# EAGLE design registers (EAGLE 5.11)

## Sheet 1 of 3
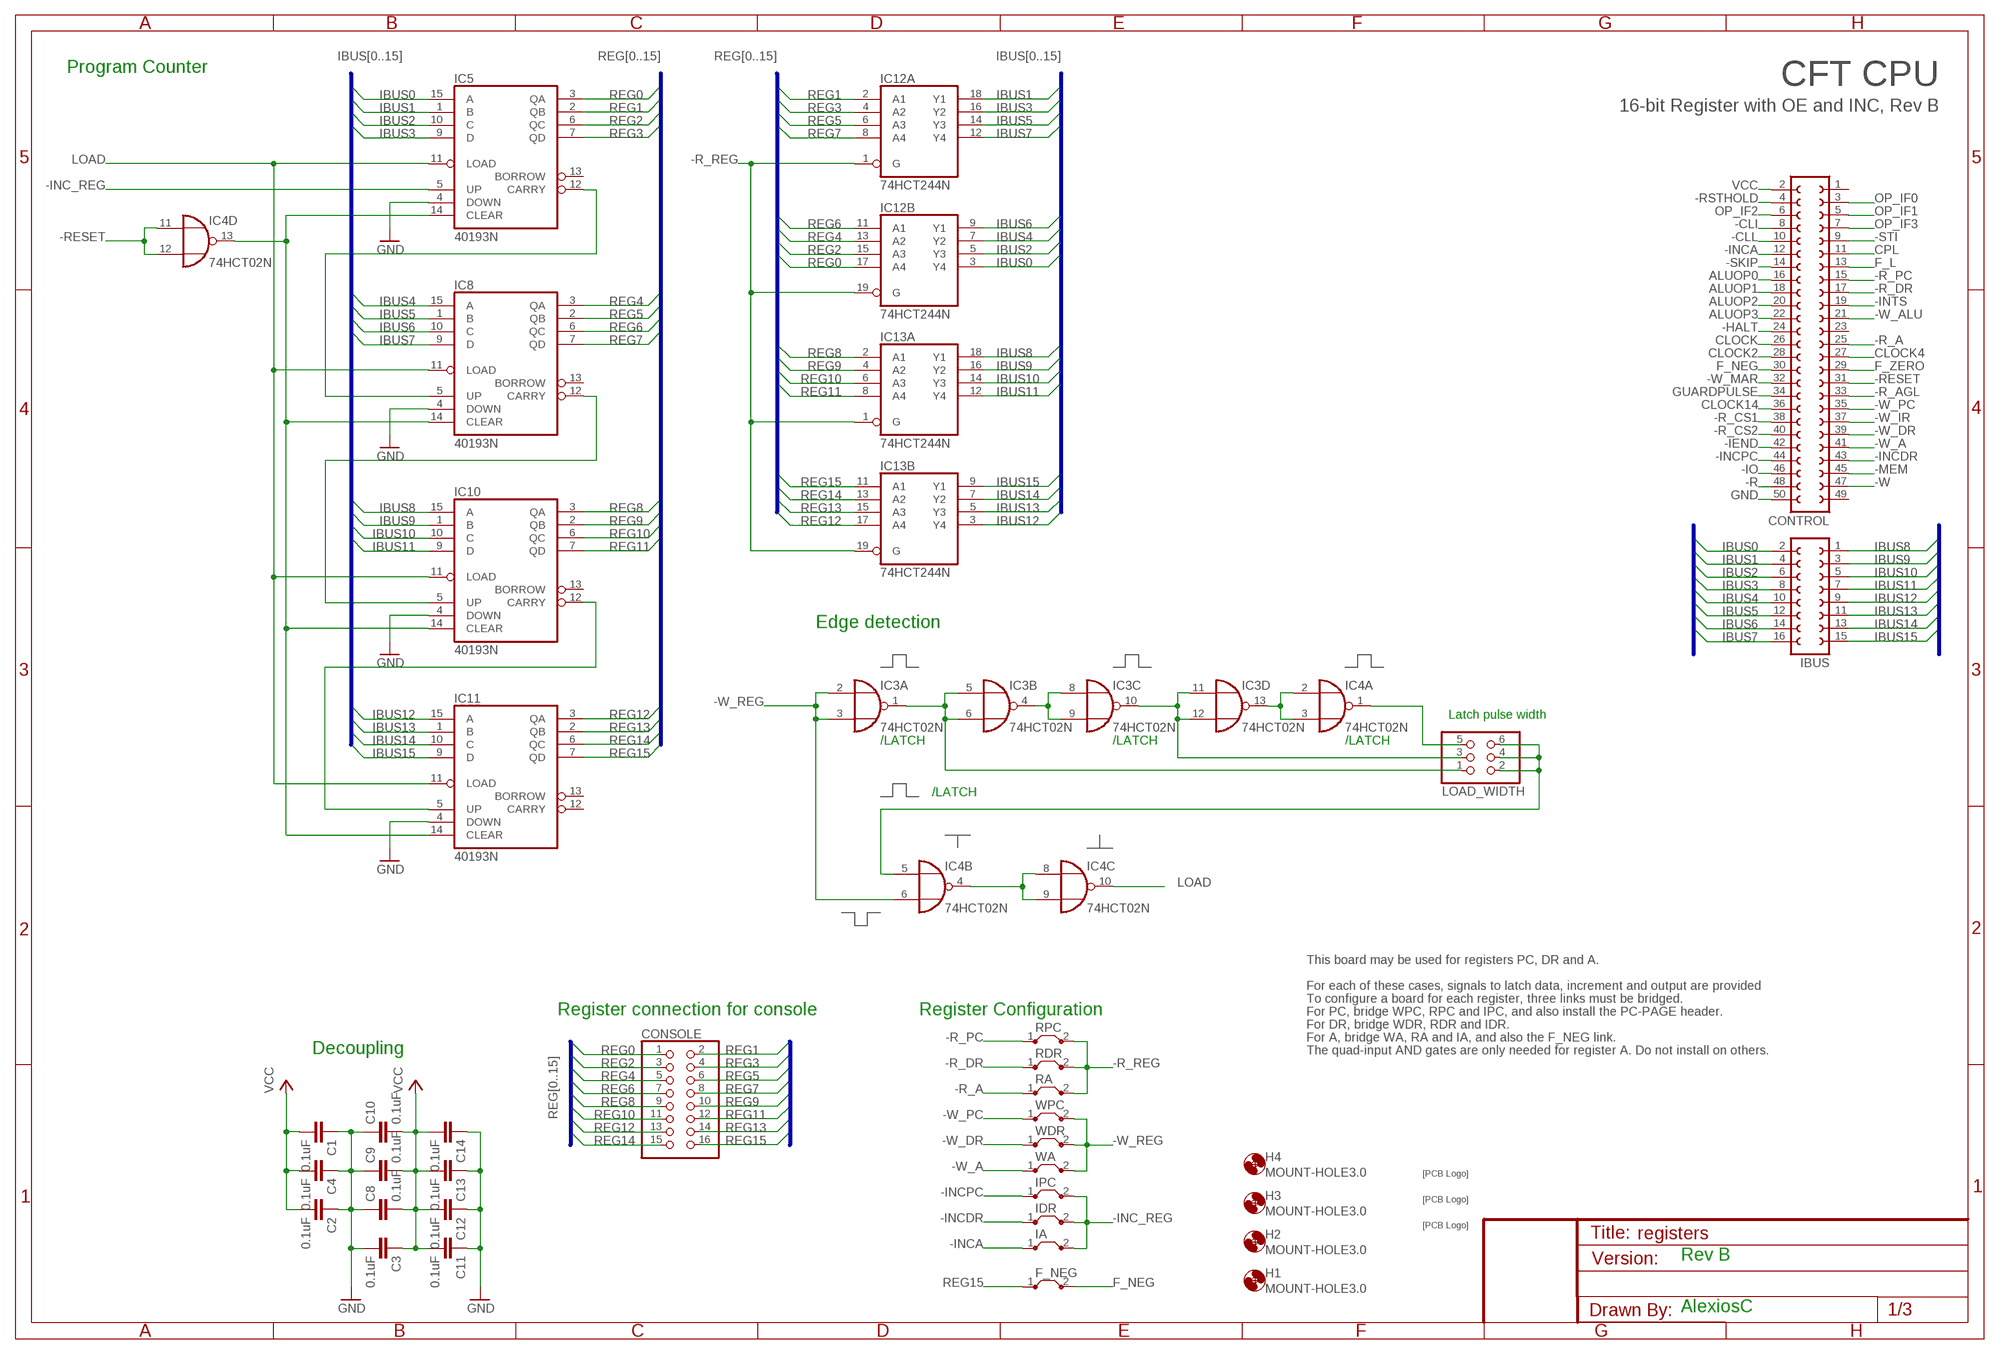
[diagram p0: schematic, sheet 1]

### Parts
C1  0.1uF  C-EU025-025X050  [C025-025X050]
C2  0.1uF  C-EU025-025X050  [C025-025X050]
C3  0.1uF  C-EU025-025X050  [C025-025X050]
C4  0.1uF  C-EU025-025X050  [C025-025X050]
C8  0.1uF  C-EU025-025X050  [C025-025X050]
C9  0.1uF  C-EU025-025X050  [C025-025X050]
C10  0.1uF  C-EU025-025X050  [C025-025X050]
C11  0.1uF  C-EU025-025X050  [C025-025X050]
C12  0.1uF  C-EU025-025X050  [C025-025X050]
C13  0.1uF  C-EU025-025X050  [C025-025X050]
C14  0.1uF  C-EU025-025X050  [C025-025X050]
CONSOLE  PINHD-2X8/90  [2X08/90]
CONTROL  FE25-2  [FE25-2]
F_NEG  J5MM  [05]
H1  MOUNT-HOLE3.0  [3,0]
H2  MOUNT-HOLE3.0  [3,0]
H3  MOUNT-HOLE3.0  [3,0]
H4  MOUNT-HOLE3.0  [3,0]
IA  J5MM  [05]
IBUS  FE08-2  [FE08-2]
IC3  74HCT02N  [DIL14]
IC4  74HCT02N  [DIL14]
IC5  40193N  [DIL16]
IC8  40193N  [DIL16]
IC10  40193N  [DIL16]
IC11  40193N  [DIL16]
IC12  74HCT244N  [DIL20]
IC13  74HCT244N  [DIL20]
IDR  J5MM  [05]
IPC  J5MM  [05]
LOAD_WIDTH  PINHD-2X3/90  [2X03/90]
RA  J5MM  [05]
RDR  J5MM  [05]
RPC  J5MM  [05]
U$1  SIGNATUREPLANE  [SIGNATURE_PLANE]
U$2  SIGNATUREPLANE  [SIGNATURE_PLANE]
U$3  SIGNATURESILK  [SIGNATURE]
WA  J5MM  [05]
WDR  J5MM  [05]
WPC  J5MM  [05]

### Nets
-CLI: CONTROL.8
-CLL: CONTROL.10
-HALT: CONTROL.24
-IEND: CONTROL.42
-INC_REG: IA.2 IC5.5(UP) IDR.2 IPC.2 ; also sheet 2,3
-INCA: CONTROL.12 IA.1
-INCDR: CONTROL.43 IDR.1
-INCPC: CONTROL.44 IPC.1
-INTS: CONTROL.19
-IO: CONTROL.46
-MEM: CONTROL.45
-R: CONTROL.48
-R_A: CONTROL.25 RA.1
-R_AGL: CONTROL.33
-R_CS1: CONTROL.38
-R_CS2: CONTROL.40
-R_DR: CONTROL.17 RDR.1
-R_PC: CONTROL.15 RPC.1
-R_REG: IC12.1(A:G) IC12.19(B:G) IC13.1(A:G) IC13.19(B:G) RA.2 RDR.2 RPC.2 ; also sheet 2,3
-RESET: CONTROL.31 IC4.11(D:I0) IC4.12(D:I1) ; also sheet 2,3
-RSTHOLD: CONTROL.4
-SKIP: CONTROL.14
-STI: CONTROL.9
-W: CONTROL.47
-W_A: CONTROL.41 WA.1
-W_ALU: CONTROL.21
-W_DR: CONTROL.39 WDR.1
-W_IR: CONTROL.37
-W_MAR: CONTROL.32
-W_PC: CONTROL.35 WPC.1
-W_REG: IC3.2(A:I0) IC3.3(A:I1) IC4.6(B:I1) WA.2 WDR.2 WPC.2 ; also sheet 2,3
ALUOP0: CONTROL.16
ALUOP1: CONTROL.18
ALUOP2: CONTROL.20
ALUOP3: CONTROL.22
CLOCK: CONTROL.26
CLOCK2: CONTROL.28
CLOCK4: CONTROL.27
CLOCK14: CONTROL.36
CPL: CONTROL.11
F_L: CONTROL.13
F_NEG: CONTROL.30
F_ZERO: CONTROL.29 ; also sheet 3
GND: C1.1 C2.1 C3.2 C4.1 C8.1 C9.1 C10.1 C11.1 C12.1 C13.1 C14.1 CONTROL.50 IC5.4(DOWN) IC8.4(DOWN) IC10.4(DOWN) IC11.4(DOWN) ; also sheet 2,3
GUARDPULSE: CONTROL.34
IBUS0: IBUS.2 IC5.15(A) IC12.3(B:Y4) ; also sheet 2,3
IBUS1: IBUS.4 IC5.1(B) IC12.18(A:Y1) ; also sheet 2,3
IBUS2: IBUS.6 IC5.10(C) IC12.5(B:Y3) ; also sheet 2,3
IBUS3: IBUS.8 IC5.9(D) IC12.16(A:Y2) ; also sheet 2,3
IBUS4: IBUS.10 IC8.15(A) IC12.7(B:Y2) ; also sheet 2,3
IBUS5: IBUS.12 IC8.1(B) IC12.14(A:Y3) ; also sheet 2,3
IBUS6: IBUS.14 IC8.10(C) IC12.9(B:Y1) ; also sheet 2,3
IBUS7: IBUS.16 IC8.9(D) IC12.12(A:Y4) ; also sheet 2,3
IBUS8: IBUS.1 IC10.15(A) IC13.18(A:Y1) ; also sheet 2,3
IBUS9: IBUS.3 IC10.1(B) IC13.16(A:Y2) ; also sheet 2,3
IBUS10: IBUS.5 IC10.10(C) IC13.14(A:Y3) ; also sheet 2,3
IBUS11: IBUS.7 IC10.9(D) IC13.12(A:Y4) ; also sheet 2,3
IBUS12: IBUS.9 IC11.15(A) IC13.3(B:Y4) ; also sheet 2,3
IBUS13: IBUS.11 IC11.1(B) IC13.5(B:Y3) ; also sheet 2,3
IBUS14: IBUS.13 IC11.10(C) IC13.7(B:Y2) ; also sheet 2,3
IBUS15: IBUS.15 IC11.9(D) IC13.9(B:Y1) ; also sheet 2,3
LOAD: IC4.10(C:O) IC5.11(LOAD) IC8.11(LOAD) IC10.11(LOAD) IC11.11(LOAD) ; also sheet 2,3
N$17: IC3.1(A:O) IC3.5(B:I0) IC3.6(B:I1) LOAD_WIDTH.1
N$18: IC3.4(B:O) IC3.8(C:I0) IC3.9(C:I1)
N$19: IC3.10(C:O) IC3.11(D:I0) IC3.12(D:I1) LOAD_WIDTH.3
N$20: IC3.13(D:O) IC4.2(A:I0) IC4.3(A:I1)
N$21: IC4.1(A:O) LOAD_WIDTH.5
N$22: IC4.5(B:I0) LOAD_WIDTH.2 LOAD_WIDTH.4 LOAD_WIDTH.6
N$23: IC4.4(B:O) IC4.8(C:I0) IC4.9(C:I1)
N$25: IC5.12(CARRY) IC8.5(UP)
N$26: IC4.13(D:O) IC5.14(CLEAR) IC8.14(CLEAR) IC10.14(CLEAR) IC11.14(CLEAR)
N$29: IC8.12(CARRY) IC10.5(UP)
N$31: IC10.12(CARRY) IC11.5(UP)
OP_IF0: CONTROL.3
OP_IF1: CONTROL.5
OP_IF2: CONTROL.6
OP_IF3: CONTROL.7
REG0: CONSOLE.1 IC5.3(QA) IC12.17(B:A4) ; also sheet 2,3
REG1: CONSOLE.2 IC5.2(QB) IC12.2(A:A1) ; also sheet 2,3
REG2: CONSOLE.3 IC5.6(QC) IC12.15(B:A3) ; also sheet 2,3
REG3: CONSOLE.4 IC5.7(QD) IC12.4(A:A2) ; also sheet 2,3
REG4: CONSOLE.5 IC8.3(QA) IC12.13(B:A2) ; also sheet 2,3
REG5: CONSOLE.6 IC8.2(QB) IC12.6(A:A3) ; also sheet 2,3
REG6: CONSOLE.7 IC8.6(QC) IC12.11(B:A1) ; also sheet 2,3
REG7: CONSOLE.8 IC8.7(QD) IC12.8(A:A4) ; also sheet 2,3
REG8: CONSOLE.9 IC10.3(QA) IC13.2(A:A1) ; also sheet 2,3
REG9: CONSOLE.10 IC10.2(QB) IC13.4(A:A2) ; also sheet 2,3
REG10: CONSOLE.11 IC10.6(QC) IC13.6(A:A3) ; also sheet 2,3
REG11: CONSOLE.12 IC10.7(QD) IC13.8(A:A4) ; also sheet 2,3
REG12: CONSOLE.13 IC11.3(QA) IC13.17(B:A4) ; also sheet 2,3
REG13: CONSOLE.14 IC11.2(QB) IC13.15(B:A3) ; also sheet 2,3
REG14: CONSOLE.15 IC11.6(QC) IC13.13(B:A2) ; also sheet 2,3
REG15: CONSOLE.16 F_NEG.1 IC11.7(QD) IC13.11(B:A1) ; also sheet 2,3
VCC: C1.2 C2.2 C3.1 C4.2 C8.2 C9.2 C10.2 C11.2 C12.2 C13.2 C14.2 CONTROL.2 ; also sheet 2,3
Unconnected: CONTROL.1 CONTROL.23 CONTROL.49 F_NEG.2 IC5.13(BORROW) IC8.13(BORROW) IC10.13(BORROW) IC11.12(CARRY) IC11.13(BORROW)

### Buses
IBUS[0..15]
REG[0..15]

### Notes on the sheet
- Program Counter
- CFT CPU
- 16-bit Register with OE and INC, Rev B
- Edge detection
- Latch pulse width
- /LATCH | /LATCH | /LATCH
- /LATCH
- This board may be used for registers PC, DR and A.
- For each of these cases, signals to latch data, increment and output are provided
- To configure a board for each register, three links must be bridged.
- Register connection for console | Register Configuration | For PC, bridge WPC, RPC and IPC, and also install the PC-PAGE header.
- For DR, bridge WDR, RDR and IDR.
- For A, bridge WA, RA and IA, and also the F_NEG link.
- Decoupling | The quad-input AND gates are only needed for register A. Do not install on others.
- Rev B
- AlexiosC

## Sheet 2 of 3
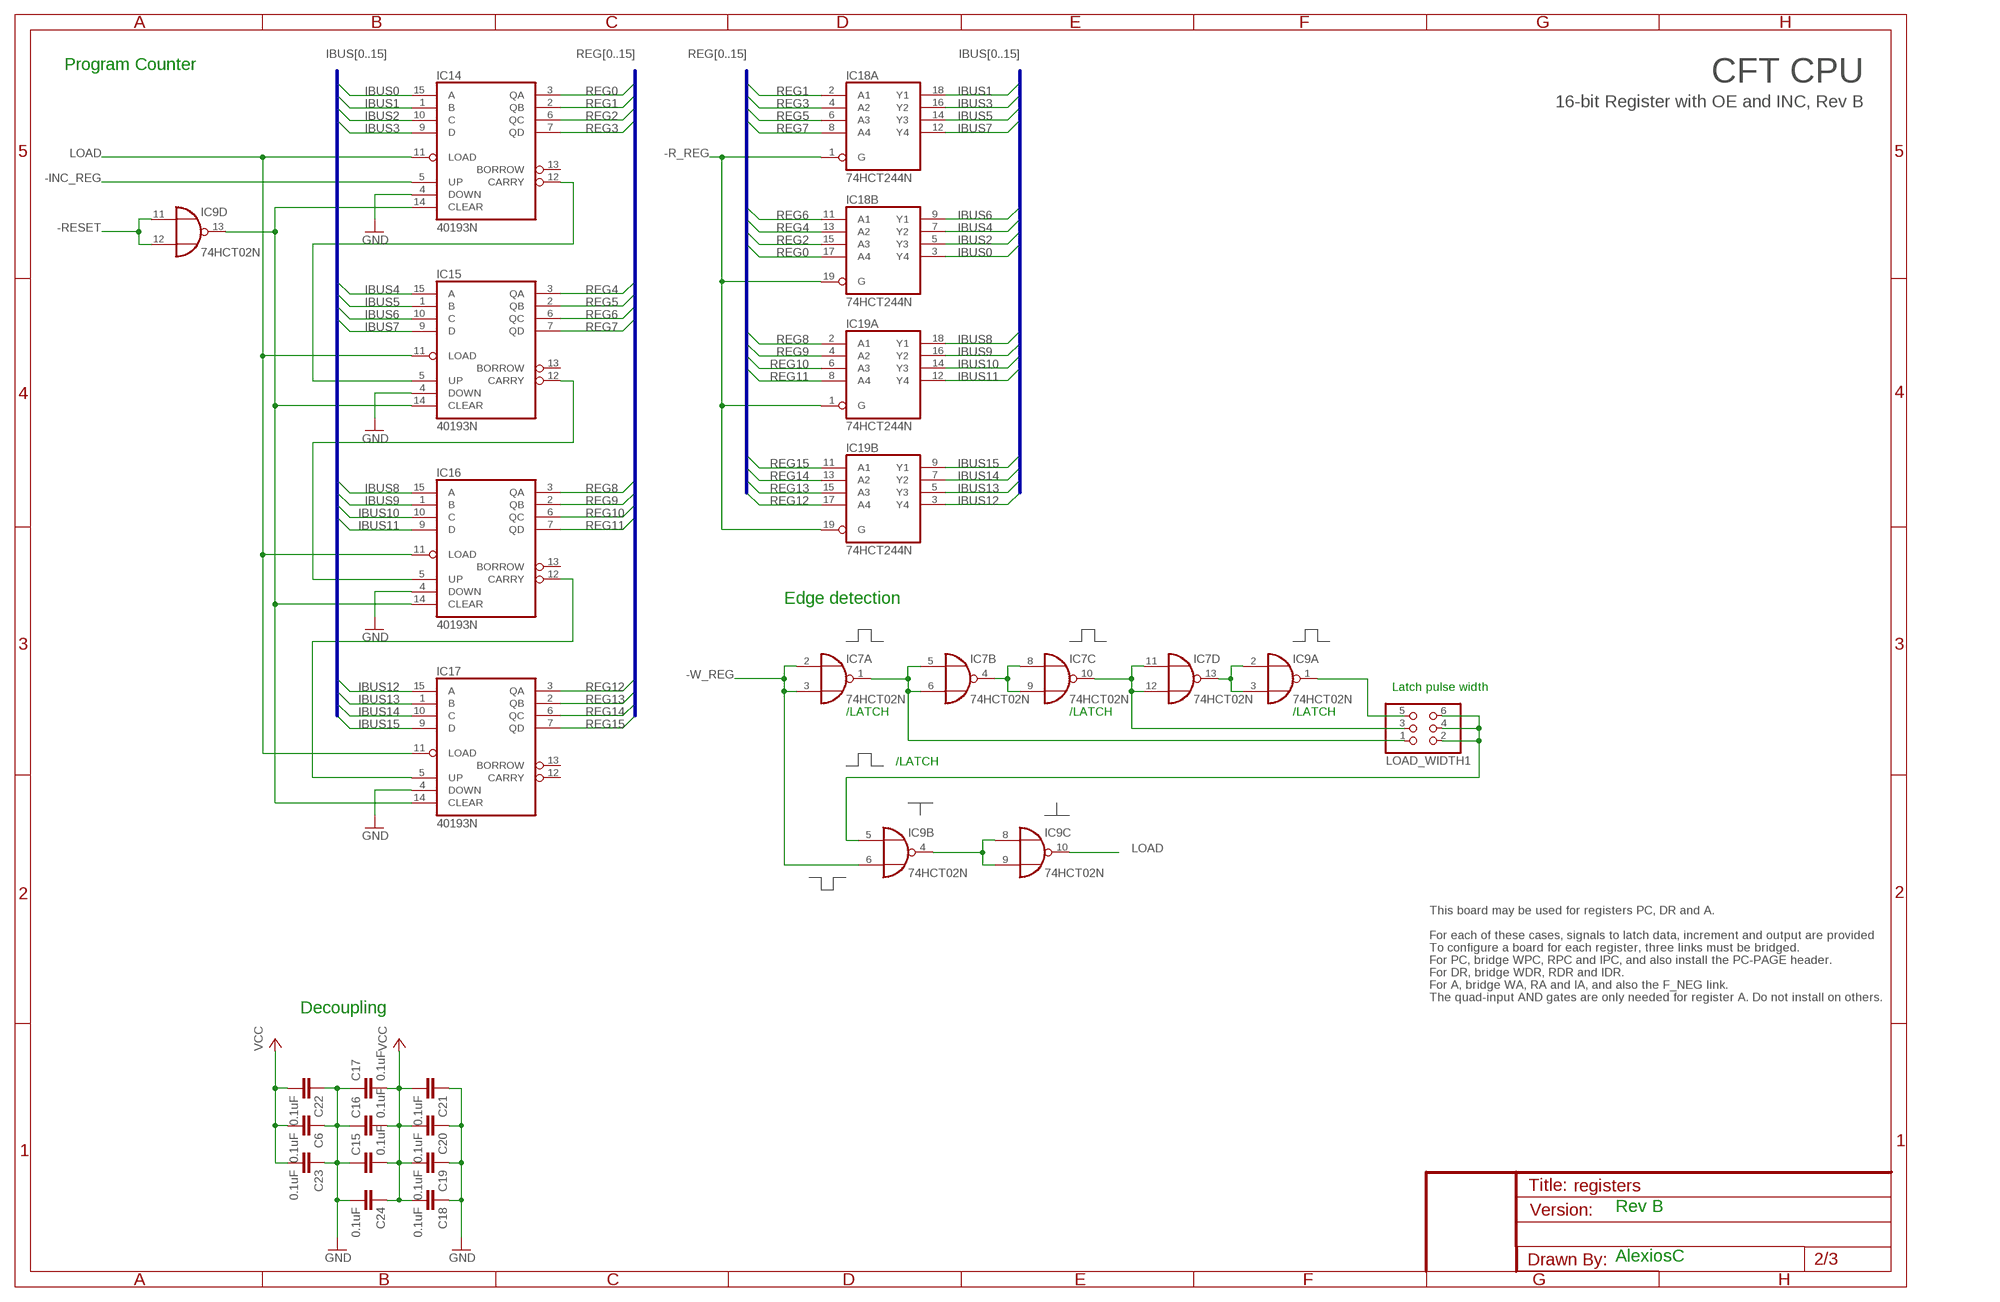
[diagram p1: schematic, sheet 2]

### Parts
C6  0.1uF  C-EU025-025X050  [C025-025X050]
C15  0.1uF  C-EU025-025X050  [C025-025X050]
C16  0.1uF  C-EU025-025X050  [C025-025X050]
C17  0.1uF  C-EU025-025X050  [C025-025X050]
C18  0.1uF  C-EU025-025X050  [C025-025X050]
C19  0.1uF  C-EU025-025X050  [C025-025X050]
C20  0.1uF  C-EU025-025X050  [C025-025X050]
C21  0.1uF  C-EU025-025X050  [C025-025X050]
C22  0.1uF  C-EU025-025X050  [C025-025X050]
C23  0.1uF  C-EU025-025X050  [C025-025X050]
C24  0.1uF  C-EU025-025X050  [C025-025X050]
IC7  74HCT02N  [DIL14]
IC9  74HCT02N  [DIL14]
IC14  40193N  [DIL16]
IC15  40193N  [DIL16]
IC16  40193N  [DIL16]
IC17  40193N  [DIL16]
IC18  74HCT244N  [DIL20]
IC19  74HCT244N  [DIL20]
LOAD_WIDTH1  PINHD-2X3/90  [2X03/90]

### Nets
-INC_REG: IC14.5(UP) ; also sheet 1,3
-R_REG: IC18.1(A:G) IC18.19(B:G) IC19.1(A:G) IC19.19(B:G) ; also sheet 1,3
-RESET: IC9.11(D:I0) IC9.12(D:I1) ; also sheet 1,3
-W_REG: IC7.2(A:I0) IC7.3(A:I1) IC9.6(B:I1) ; also sheet 1,3
GND: C6.1 C15.1 C16.1 C17.1 C18.1 C19.1 C20.1 C21.1 C22.1 C23.1 C24.2 IC14.4(DOWN) IC15.4(DOWN) IC16.4(DOWN) IC17.4(DOWN) ; also sheet 1,3
IBUS0: IC14.15(A) IC18.3(B:Y4) ; also sheet 1,3
IBUS1: IC14.1(B) IC18.18(A:Y1) ; also sheet 1,3
IBUS2: IC14.10(C) IC18.5(B:Y3) ; also sheet 1,3
IBUS3: IC14.9(D) IC18.16(A:Y2) ; also sheet 1,3
IBUS4: IC15.15(A) IC18.7(B:Y2) ; also sheet 1,3
IBUS5: IC15.1(B) IC18.14(A:Y3) ; also sheet 1,3
IBUS6: IC15.10(C) IC18.9(B:Y1) ; also sheet 1,3
IBUS7: IC15.9(D) IC18.12(A:Y4) ; also sheet 1,3
IBUS8: IC16.15(A) IC19.18(A:Y1) ; also sheet 1,3
IBUS9: IC16.1(B) IC19.16(A:Y2) ; also sheet 1,3
IBUS10: IC16.10(C) IC19.14(A:Y3) ; also sheet 1,3
IBUS11: IC16.9(D) IC19.12(A:Y4) ; also sheet 1,3
IBUS12: IC17.15(A) IC19.3(B:Y4) ; also sheet 1,3
IBUS13: IC17.1(B) IC19.5(B:Y3) ; also sheet 1,3
IBUS14: IC17.10(C) IC19.7(B:Y2) ; also sheet 1,3
IBUS15: IC17.9(D) IC19.9(B:Y1) ; also sheet 1,3
LOAD: IC9.10(C:O) IC14.11(LOAD) IC15.11(LOAD) IC16.11(LOAD) IC17.11(LOAD) ; also sheet 1,3
N$5: IC7.1(A:O) IC7.5(B:I0) IC7.6(B:I1) LOAD_WIDTH1.1
N$6: IC7.4(B:O) IC7.8(C:I0) IC7.9(C:I1)
N$7: IC7.10(C:O) IC7.11(D:I0) IC7.12(D:I1) LOAD_WIDTH1.3
N$8: IC7.13(D:O) IC9.2(A:I0) IC9.3(A:I1)
N$9: IC9.1(A:O) LOAD_WIDTH1.5
N$10: IC9.5(B:I0) LOAD_WIDTH1.2 LOAD_WIDTH1.4 LOAD_WIDTH1.6
N$11: IC9.4(B:O) IC9.8(C:I0) IC9.9(C:I1)
N$12: IC9.13(D:O) IC14.14(CLEAR) IC15.14(CLEAR) IC16.14(CLEAR) IC17.14(CLEAR)
N$13: IC14.12(CARRY) IC15.5(UP)
N$14: IC15.12(CARRY) IC16.5(UP)
N$15: IC16.12(CARRY) IC17.5(UP)
REG0: IC14.3(QA) IC18.17(B:A4) ; also sheet 1,3
REG1: IC14.2(QB) IC18.2(A:A1) ; also sheet 1,3
REG2: IC14.6(QC) IC18.15(B:A3) ; also sheet 1,3
REG3: IC14.7(QD) IC18.4(A:A2) ; also sheet 1,3
REG4: IC15.3(QA) IC18.13(B:A2) ; also sheet 1,3
REG5: IC15.2(QB) IC18.6(A:A3) ; also sheet 1,3
REG6: IC15.6(QC) IC18.11(B:A1) ; also sheet 1,3
REG7: IC15.7(QD) IC18.8(A:A4) ; also sheet 1,3
REG8: IC16.3(QA) IC19.2(A:A1) ; also sheet 1,3
REG9: IC16.2(QB) IC19.4(A:A2) ; also sheet 1,3
REG10: IC16.6(QC) IC19.6(A:A3) ; also sheet 1,3
REG11: IC16.7(QD) IC19.8(A:A4) ; also sheet 1,3
REG12: IC17.3(QA) IC19.17(B:A4) ; also sheet 1,3
REG13: IC17.2(QB) IC19.15(B:A3) ; also sheet 1,3
REG14: IC17.6(QC) IC19.13(B:A2) ; also sheet 1,3
REG15: IC17.7(QD) IC19.11(B:A1) ; also sheet 1,3
VCC: C6.2 C15.2 C16.2 C17.2 C18.2 C19.2 C20.2 C21.2 C22.2 C23.2 C24.1 ; also sheet 1,3
Unconnected: IC14.13(BORROW) IC15.13(BORROW) IC16.13(BORROW) IC17.12(CARRY) IC17.13(BORROW)

### Buses
IBUS[0..15]
REG[0..15]

### Notes on the sheet
- Program Counter
- CFT CPU
- 16-bit Register with OE and INC, Rev B
- Edge detection
- Latch pulse width
- /LATCH | /LATCH | /LATCH
- /LATCH
- This board may be used for registers PC, DR and A.
- For each of these cases, signals to latch data, increment and output are provided
- To configure a board for each register, three links must be bridged.
- For PC, bridge WPC, RPC and IPC, and also install the PC-PAGE header.
- For DR, bridge WDR, RDR and IDR.
- For A, bridge WA, RA and IA, and also the F_NEG link.
- The quad-input AND gates are only needed for register A. Do not install on others.
- Decoupling
- Rev B
- AlexiosC

## Sheet 3 of 3
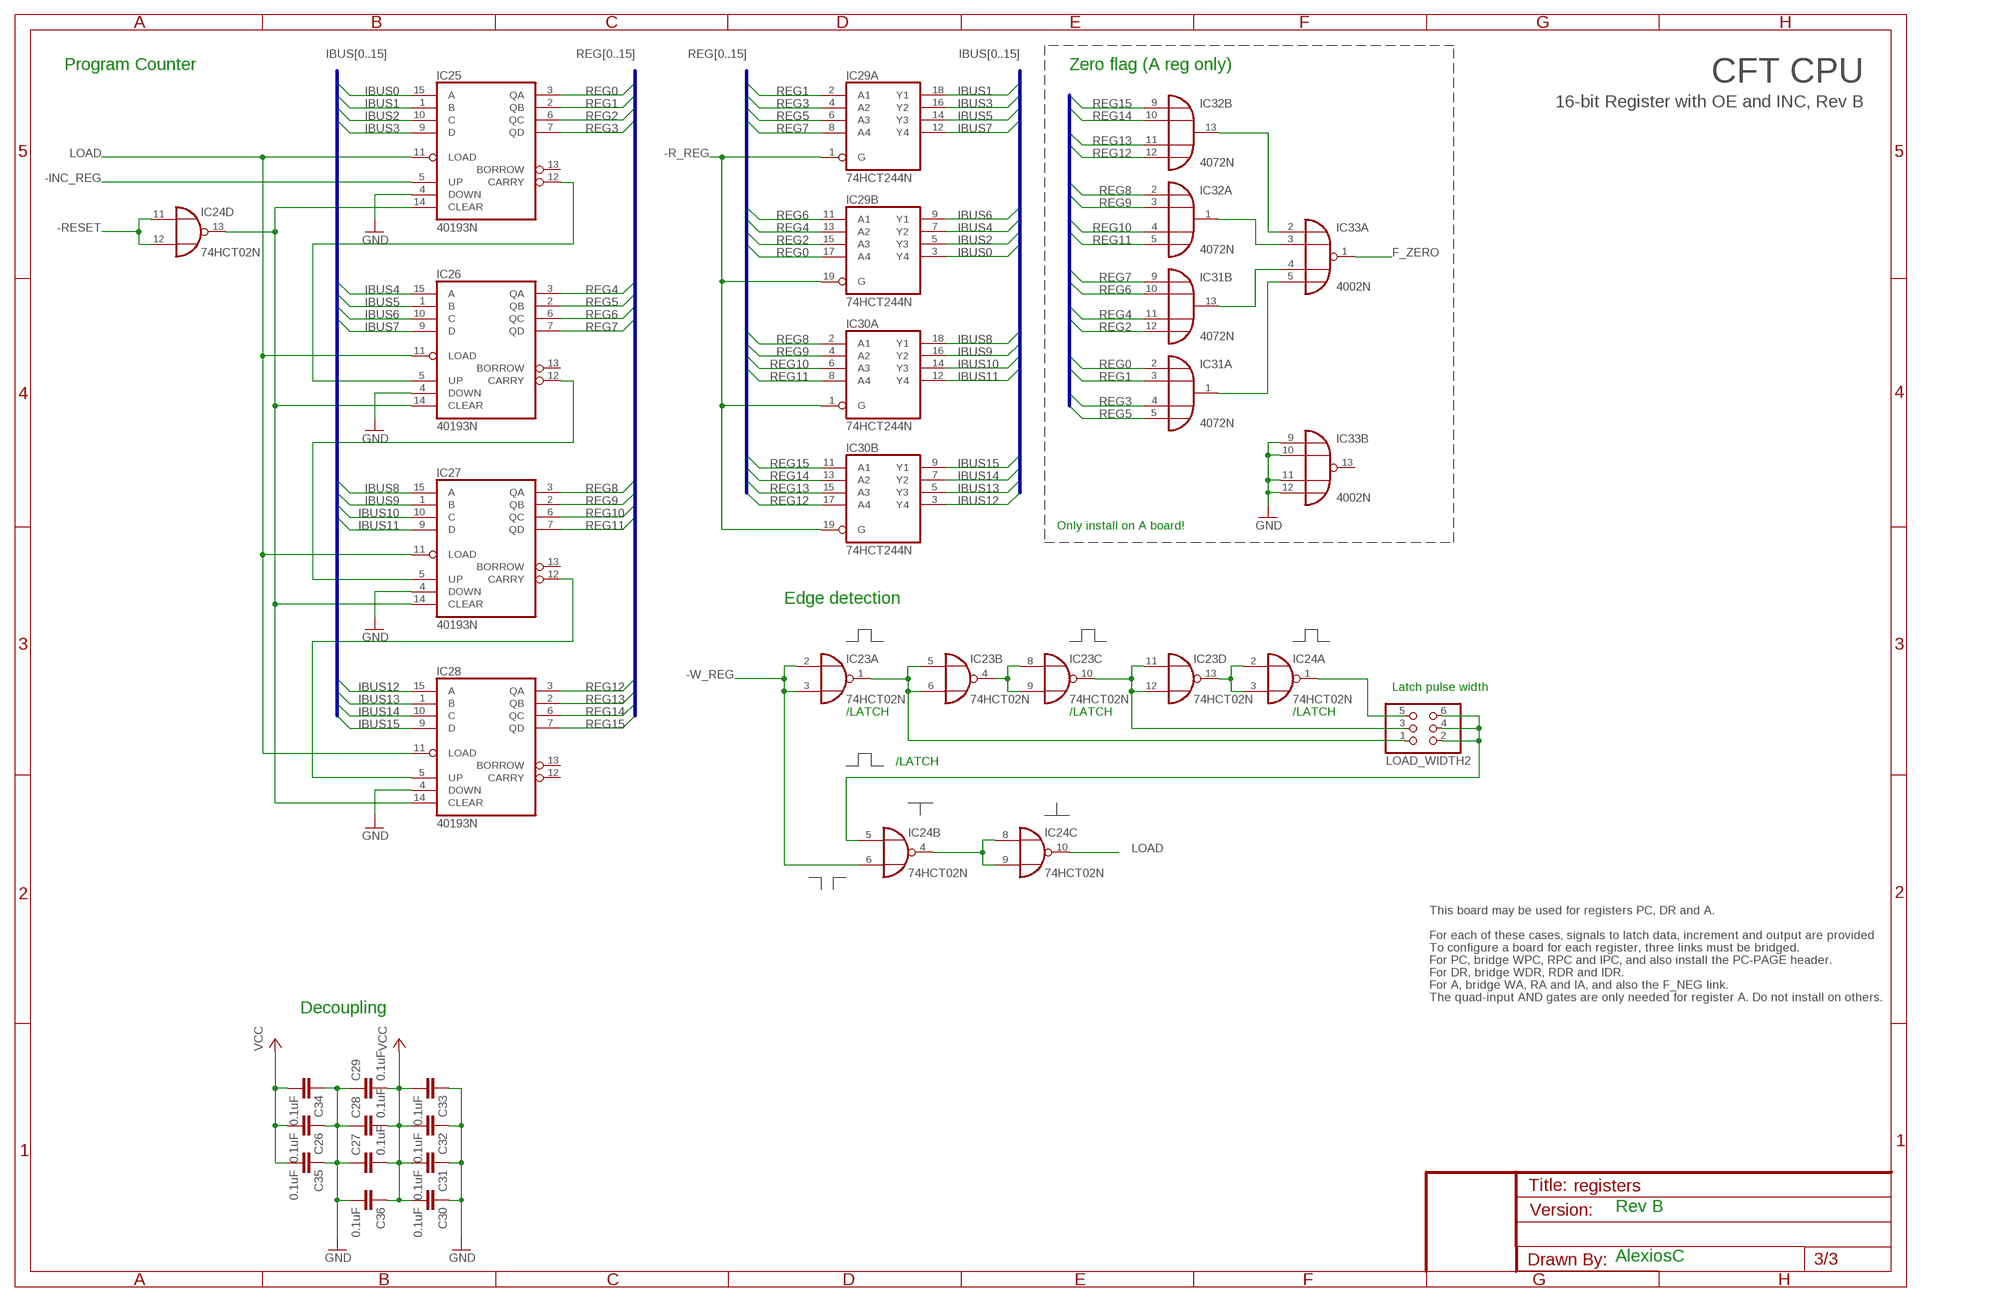
[diagram p2: schematic, sheet 3]

### Parts
C26  0.1uF  C-EU025-025X050  [C025-025X050]
C27  0.1uF  C-EU025-025X050  [C025-025X050]
C28  0.1uF  C-EU025-025X050  [C025-025X050]
C29  0.1uF  C-EU025-025X050  [C025-025X050]
C30  0.1uF  C-EU025-025X050  [C025-025X050]
C31  0.1uF  C-EU025-025X050  [C025-025X050]
C32  0.1uF  C-EU025-025X050  [C025-025X050]
C33  0.1uF  C-EU025-025X050  [C025-025X050]
C34  0.1uF  C-EU025-025X050  [C025-025X050]
C35  0.1uF  C-EU025-025X050  [C025-025X050]
C36  0.1uF  C-EU025-025X050  [C025-025X050]
IC23  74HCT02N  [DIL14]
IC24  74HCT02N  [DIL14]
IC25  40193N  [DIL16]
IC26  40193N  [DIL16]
IC27  40193N  [DIL16]
IC28  40193N  [DIL16]
IC29  74HCT244N  [DIL20]
IC30  74HCT244N  [DIL20]
IC31  4072N  [DIL14]
IC32  4072N  [DIL14]
IC33  4002N  [DIL14]
LOAD_WIDTH2  PINHD-2X3/90  [2X03/90]

### Nets
-INC_REG: IC25.5(UP) ; also sheet 1,2
-R_REG: IC29.1(A:G) IC29.19(B:G) IC30.1(A:G) IC30.19(B:G) ; also sheet 1,2
-RESET: IC24.11(D:I0) IC24.12(D:I1) ; also sheet 1,2
-W_REG: IC23.2(A:I0) IC23.3(A:I1) IC24.6(B:I1) ; also sheet 1,2
F_ZERO: IC33.1(A:O) ; also sheet 1
GND: C26.1 C27.1 C28.1 C29.1 C30.1 C31.1 C32.1 C33.1 C34.1 C35.1 C36.2 IC25.4(DOWN) IC26.4(DOWN) IC27.4(DOWN) IC28.4(DOWN) IC33.9(B:I0) IC33.10(B:I1) IC33.11(B:I2) IC33.12(B:I3) ; also sheet 1,2
IBUS0: IC25.15(A) IC29.3(B:Y4) ; also sheet 1,2
IBUS1: IC25.1(B) IC29.18(A:Y1) ; also sheet 1,2
IBUS2: IC25.10(C) IC29.5(B:Y3) ; also sheet 1,2
IBUS3: IC25.9(D) IC29.16(A:Y2) ; also sheet 1,2
IBUS4: IC26.15(A) IC29.7(B:Y2) ; also sheet 1,2
IBUS5: IC26.1(B) IC29.14(A:Y3) ; also sheet 1,2
IBUS6: IC26.10(C) IC29.9(B:Y1) ; also sheet 1,2
IBUS7: IC26.9(D) IC29.12(A:Y4) ; also sheet 1,2
IBUS8: IC27.15(A) IC30.18(A:Y1) ; also sheet 1,2
IBUS9: IC27.1(B) IC30.16(A:Y2) ; also sheet 1,2
IBUS10: IC27.10(C) IC30.14(A:Y3) ; also sheet 1,2
IBUS11: IC27.9(D) IC30.12(A:Y4) ; also sheet 1,2
IBUS12: IC28.15(A) IC30.3(B:Y4) ; also sheet 1,2
IBUS13: IC28.1(B) IC30.5(B:Y3) ; also sheet 1,2
IBUS14: IC28.10(C) IC30.7(B:Y2) ; also sheet 1,2
IBUS15: IC28.9(D) IC30.9(B:Y1) ; also sheet 1,2
LOAD: IC24.10(C:O) IC25.11(LOAD) IC26.11(LOAD) IC27.11(LOAD) IC28.11(LOAD) ; also sheet 1,2
N$30: IC23.1(A:O) IC23.5(B:I0) IC23.6(B:I1) LOAD_WIDTH2.1
N$32: IC23.4(B:O) IC23.8(C:I0) IC23.9(C:I1)
N$33: IC23.10(C:O) IC23.11(D:I0) IC23.12(D:I1) LOAD_WIDTH2.3
N$34: IC23.13(D:O) IC24.2(A:I0) IC24.3(A:I1)
N$35: IC24.1(A:O) LOAD_WIDTH2.5
N$36: IC24.5(B:I0) LOAD_WIDTH2.2 LOAD_WIDTH2.4 LOAD_WIDTH2.6
N$37: IC24.4(B:O) IC24.8(C:I0) IC24.9(C:I1)
N$38: IC24.13(D:O) IC25.14(CLEAR) IC26.14(CLEAR) IC27.14(CLEAR) IC28.14(CLEAR)
N$39: IC25.12(CARRY) IC26.5(UP)
N$40: IC26.12(CARRY) IC27.5(UP)
N$41: IC27.12(CARRY) IC28.5(UP)
N$42: IC32.13(B:O) IC33.2(A:I0)
N$43: IC32.1(A:O) IC33.3(A:I1)
N$44: IC31.13(B:O) IC33.4(A:I2)
N$45: IC31.1(A:O) IC33.5(A:I3)
REG0: IC25.3(QA) IC29.17(B:A4) IC31.2(A:I0) ; also sheet 1,2
REG1: IC25.2(QB) IC29.2(A:A1) IC31.3(A:I1) ; also sheet 1,2
REG2: IC25.6(QC) IC29.15(B:A3) IC31.12(B:I3) ; also sheet 1,2
REG3: IC25.7(QD) IC29.4(A:A2) IC31.4(A:I2) ; also sheet 1,2
REG4: IC26.3(QA) IC29.13(B:A2) IC31.11(B:I2) ; also sheet 1,2
REG5: IC26.2(QB) IC29.6(A:A3) IC31.5(A:I3) ; also sheet 1,2
REG6: IC26.6(QC) IC29.11(B:A1) IC31.10(B:I1) ; also sheet 1,2
REG7: IC26.7(QD) IC29.8(A:A4) IC31.9(B:I0) ; also sheet 1,2
REG8: IC27.3(QA) IC30.2(A:A1) IC32.2(A:I0) ; also sheet 1,2
REG9: IC27.2(QB) IC30.4(A:A2) IC32.3(A:I1) ; also sheet 1,2
REG10: IC27.6(QC) IC30.6(A:A3) IC32.4(A:I2) ; also sheet 1,2
REG11: IC27.7(QD) IC30.8(A:A4) IC32.5(A:I3) ; also sheet 1,2
REG12: IC28.3(QA) IC30.17(B:A4) IC32.12(B:I3) ; also sheet 1,2
REG13: IC28.2(QB) IC30.15(B:A3) IC32.11(B:I2) ; also sheet 1,2
REG14: IC28.6(QC) IC30.13(B:A2) IC32.10(B:I1) ; also sheet 1,2
REG15: IC28.7(QD) IC30.11(B:A1) IC32.9(B:I0) ; also sheet 1,2
VCC: C26.2 C27.2 C28.2 C29.2 C30.2 C31.2 C32.2 C33.2 C34.2 C35.2 C36.1 ; also sheet 1,2
Unconnected: IC25.13(BORROW) IC26.13(BORROW) IC27.13(BORROW) IC28.12(CARRY) IC28.13(BORROW) IC33.13(B:O)

### Buses
IBUS[0..15]
REG[0..15]

### Notes on the sheet
- Program Counter | Zero flag (A reg only)
- CFT CPU
- 16-bit Register with OE and INC, Rev B
- Only install on A board!
- Edge detection
- Latch pulse width
- /LATCH | /LATCH | /LATCH
- /LATCH
- This board may be used for registers PC, DR and A.
- For each of these cases, signals to latch data, increment and output are provided
- To configure a board for each register, three links must be bridged.
- For PC, bridge WPC, RPC and IPC, and also install the PC-PAGE header.
- For DR, bridge WDR, RDR and IDR.
- For A, bridge WA, RA and IA, and also the F_NEG link.
- The quad-input AND gates are only needed for register A. Do not install on others.
- Decoupling
- Rev B
- AlexiosC

## Power pins joined to a net without a drawn wire
GND: IC3.7(P:GND) IC4.7(P:GND) IC5.8(VSS) IC7.7(P:GND) IC8.8(VSS) IC9.7(P:GND) IC10.8(VSS) IC11.8(VSS) IC12.10(P:GND) IC13.10(P:GND) IC18.10(P:GND) IC19.10(P:GND) IC23.7(P:GND) IC24.7(P:GND) IC29.10(P:GND) IC30.10(P:GND)
VCC: IC3.14(P:VCC) IC4.14(P:VCC) IC5.16(VDD) IC7.14(P:VCC) IC8.16(VDD) IC9.14(P:VCC) IC10.16(VDD) IC11.16(VDD) IC12.20(P:VCC) IC13.20(P:VCC) IC18.20(P:VCC) IC19.20(P:VCC) IC23.14(P:VCC) IC24.14(P:VCC) IC29.20(P:VCC) IC30.20(P:VCC)
VDD: IC14.16(VDD) IC15.16(VDD) IC16.16(VDD) IC17.16(VDD) IC25.16(VDD) IC26.16(VDD) IC27.16(VDD) IC28.16(VDD) IC31.14(P:VDD) IC32.14(P:VDD) IC33.14(P:VDD)
VSS: IC14.8(VSS) IC15.8(VSS) IC16.8(VSS) IC17.8(VSS) IC25.8(VSS) IC26.8(VSS) IC27.8(VSS) IC28.8(VSS) IC31.7(P:VSS) IC32.7(P:VSS) IC33.7(P:VSS)

## Library data of the parts
C1-C4 C6 C8-C24 C26-C36 = rcl:C-EU: CAPACITOR, European symbol
CONSOLE = pinhead:PINHD-2X8: PIN HEADER
CONTROL = con-lsta:FE25-2: FEMALE HEADER
F_NEG IA IDR IPC RA RDR RPC WA WDR WPC = jumper:J: Bridge
H1-H4 = holes:MOUNT-HOLE: MOUNTING HOLE with drill center marker
IBUS = con-lsta:FE08-2: FEMALE HEADER
IC3 IC4 IC7 IC9 IC23 IC24 = 74xx-eu:74*02: Quad 2-input NOR gate
IC5 IC8 IC10 IC11 IC14-IC17 IC25-IC28 = 40xx:40193: Binary up down COUNTER
IC12 IC13 IC18 IC19 IC29 IC30 = 74xx-eu:74*244: Octal BUFFER and LINE DRIVER, 3-state
IC31 IC32 = 40xx:4072: Dual 4-input OR
IC33 = 40xx:4002: 4-input NOR
LOAD_WIDTH LOAD_WIDTH1 LOAD_WIDTH2 = pinhead:PINHD-2X3: PIN HEADER
U$1-U$3 = alexios:SIGNATURE: Soup signature

## Net classes
1 Decoupling: width 1.27 mm

## Board
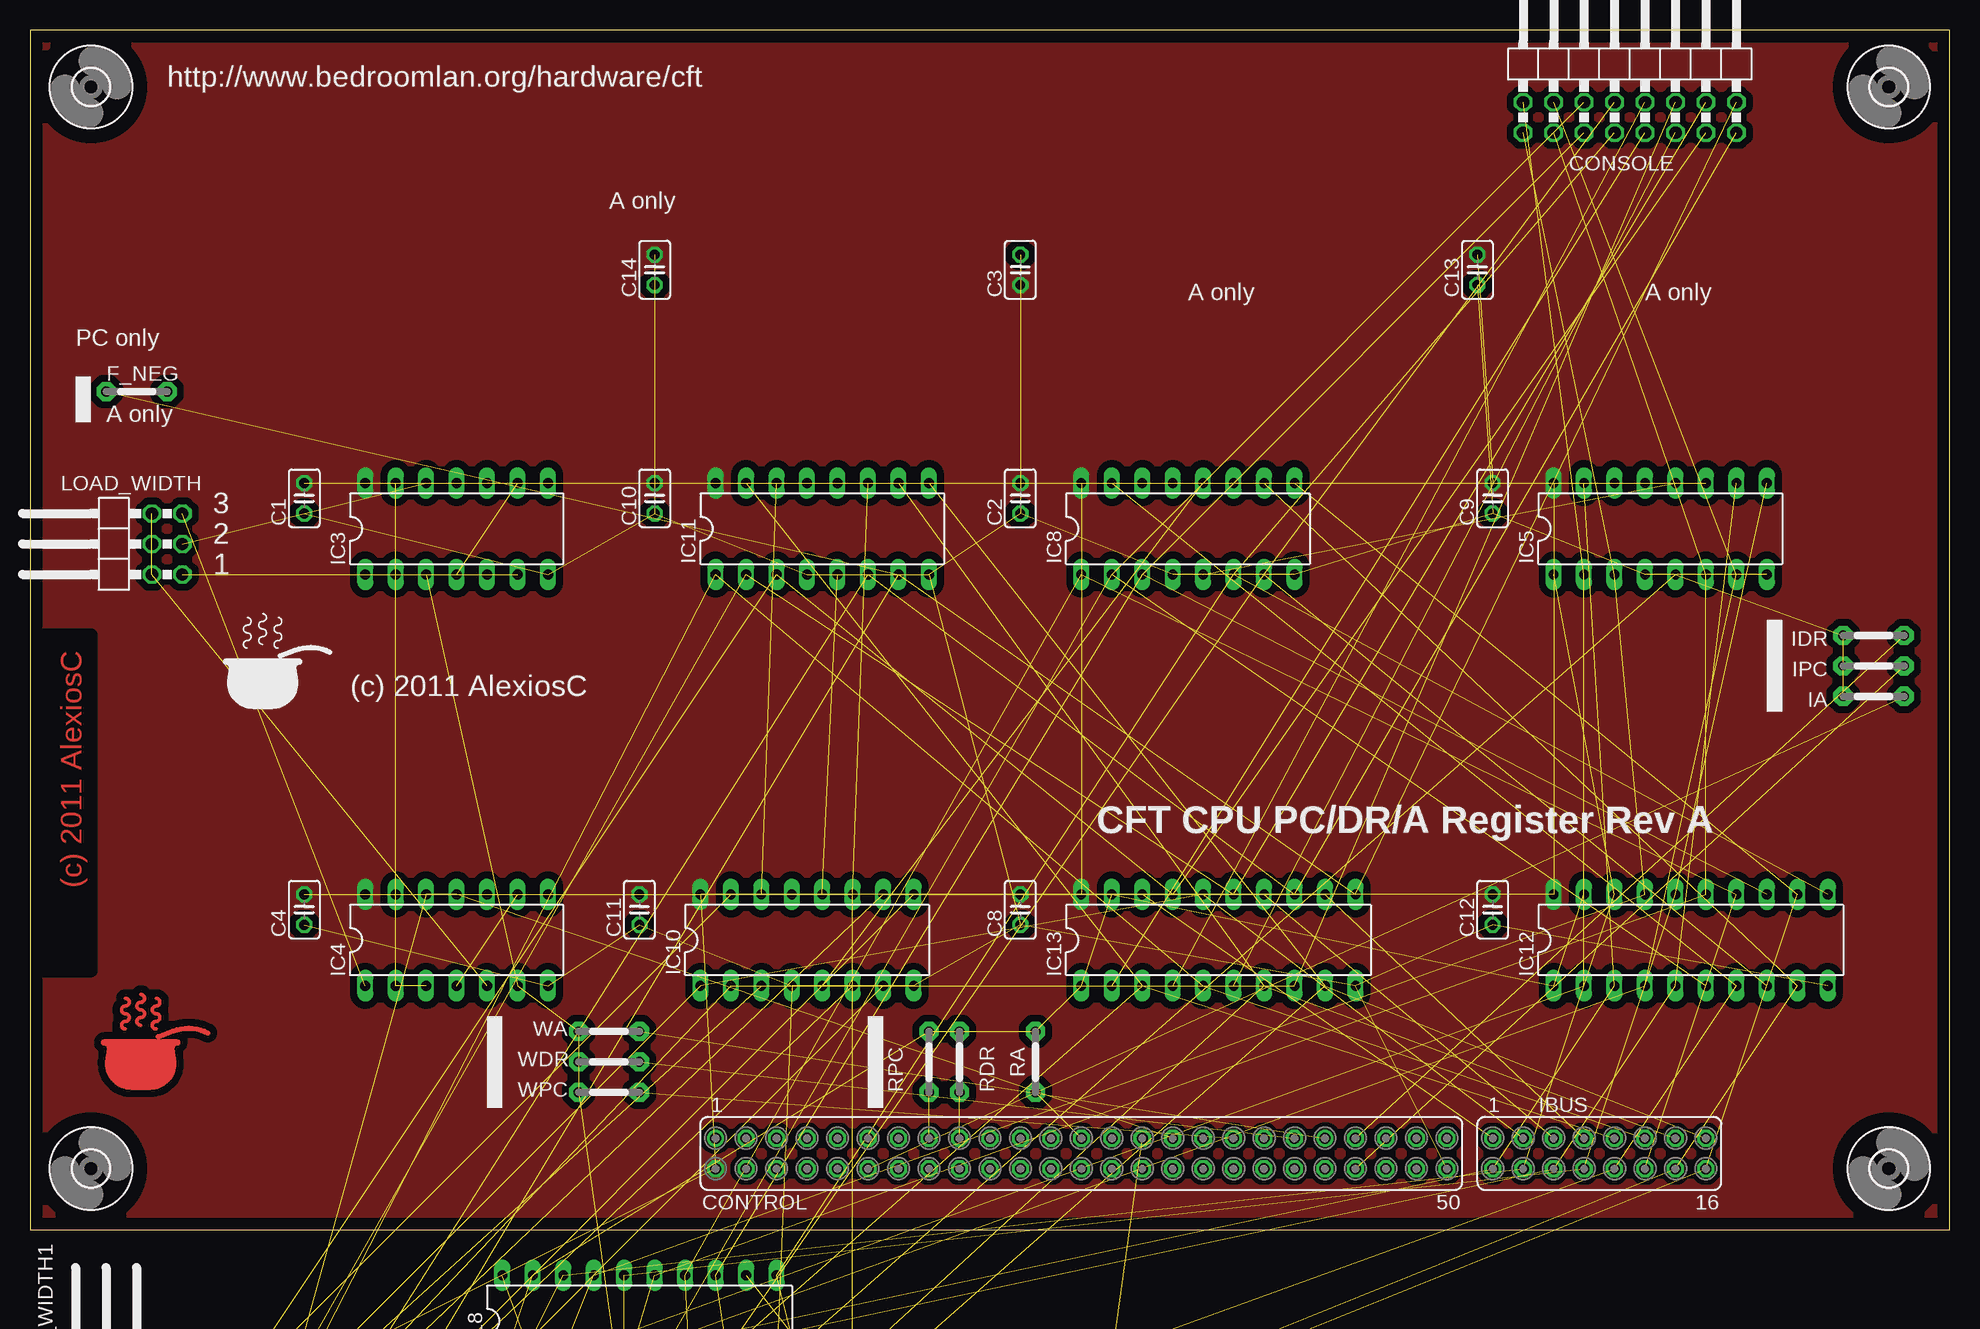
[diagram p3: board, top side]
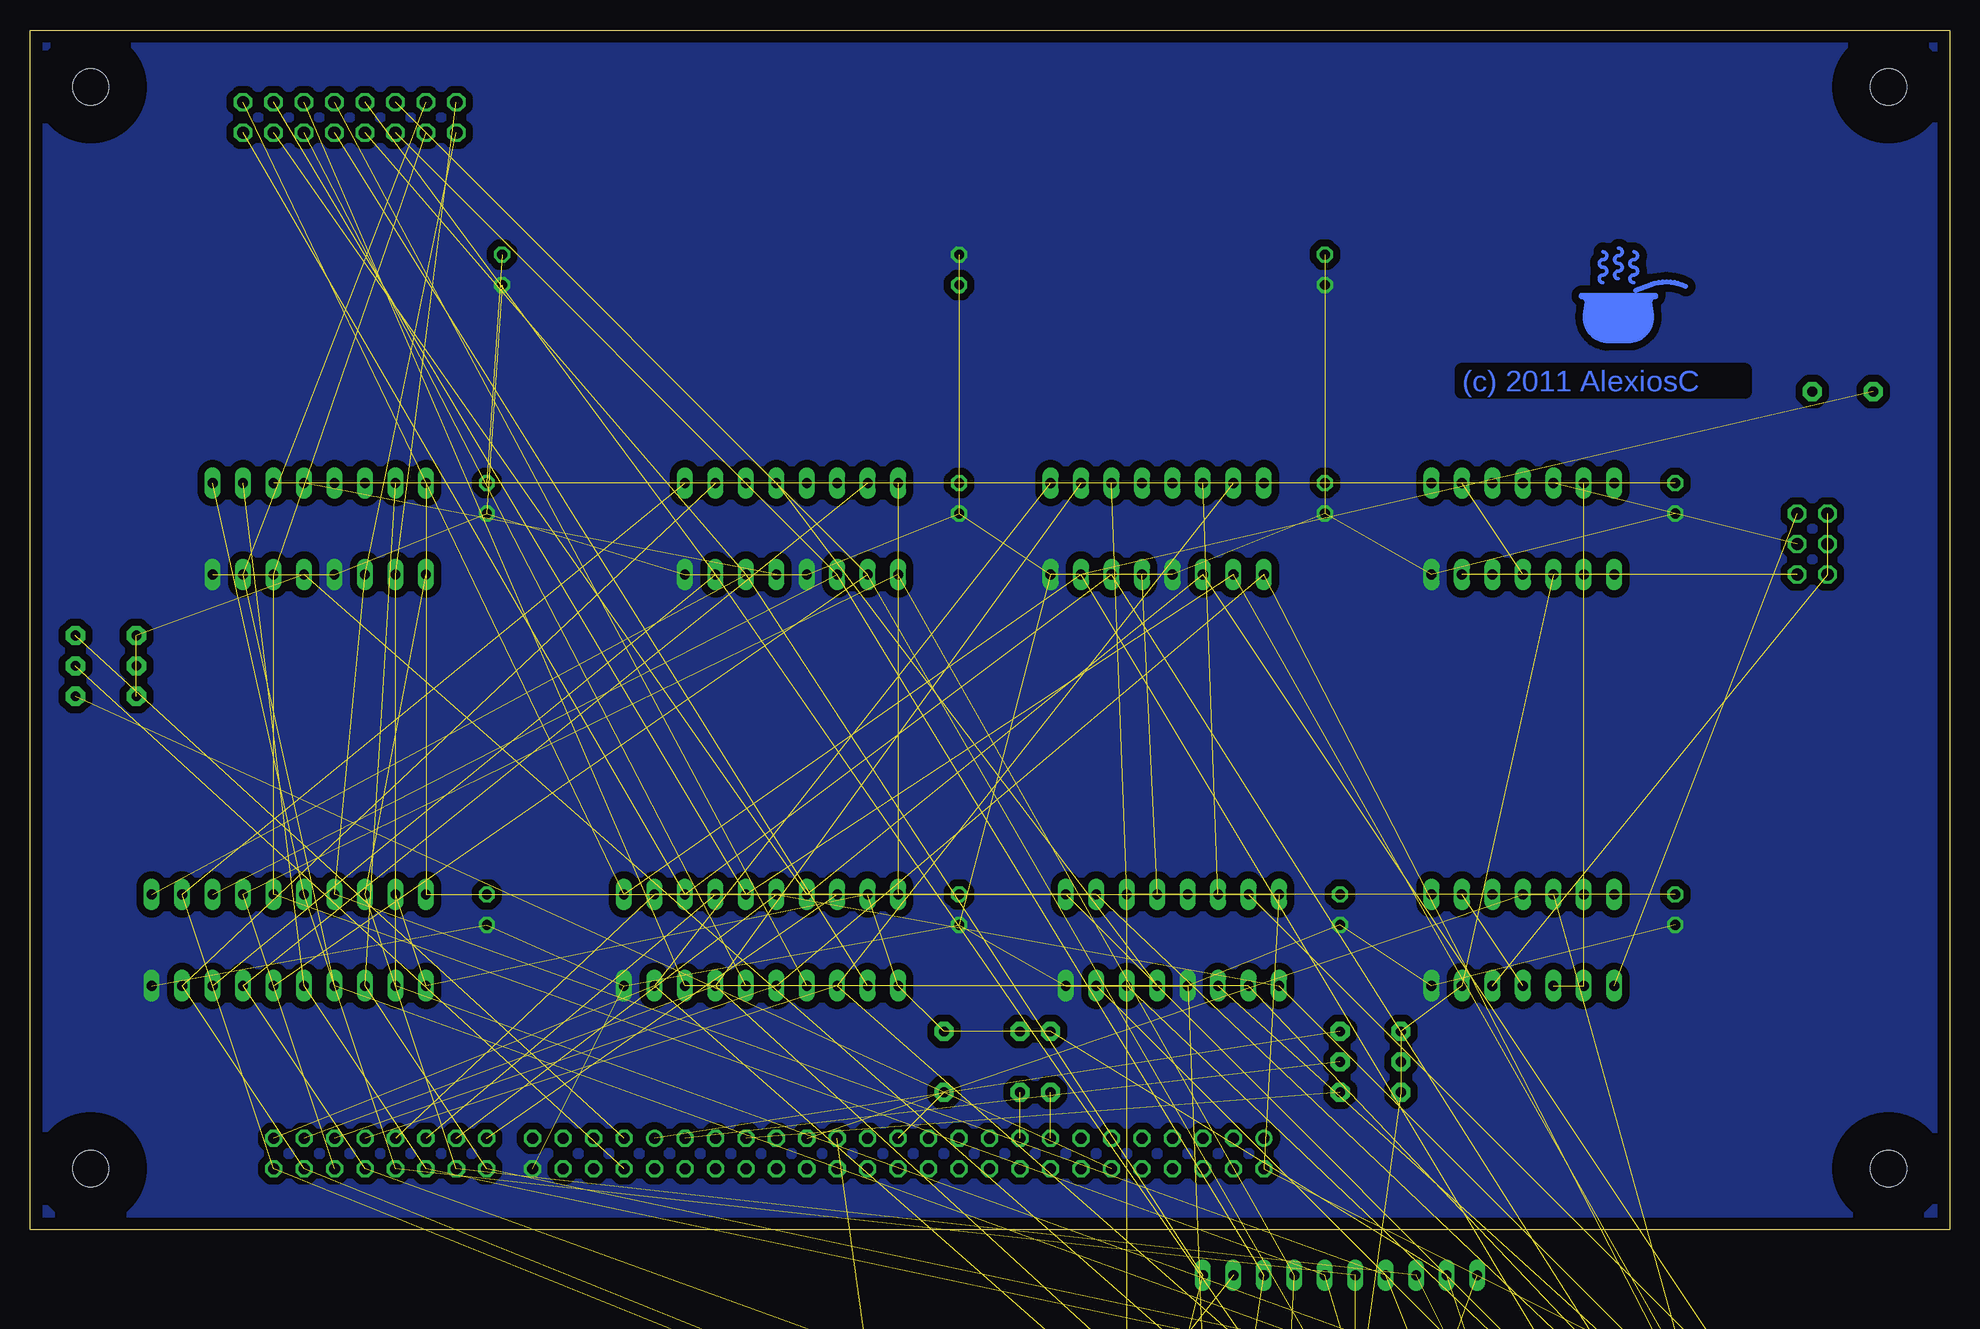
[diagram p4: board, bottom side, seen from below]

Size 160 x 100 mm. Coordinates in mm from the lower left corner, seen from the top.
Outline: 0,0 160,0 160,100 0,100 0,0
Copper layers (1*16): Top 0.035mm / dielectric 1.5mm / Bottom 0.035mm
Design rules "olimex-10mil": minimum track width 10mil, minimum drill 24mil, track to track 10mil, track to pad 10mil, pad to pad 10mil, via to via 10mil, smd to smd 10mil, copper to edge 40mil, drill to drill 10mil, minimum pad ring 10mil, minimum via ring 8mil, stop-mask expansion 0mil, vias tented up to drill 0mil, thermal gap 10mil
tRestrict: area 1.3,21.6 to 5.1,49.5

### Footprints (pad centres in the part's own frame; a part is rotated, then mirrored left to right if it is on the bottom)
C025-025X050 = drill 0.813 octagon: 1 -1.27,0; 2 1.27,0
2X08/90 = drill 1.016 octagon: 1 -8.89,-6.35; 2 -8.89,-3.81; 3 -6.35,-6.35; 4 -6.35,-3.81; 5 -3.81,-6.35; 6 -3.81,-3.81; 7 -1.27,-6.35; 8 -1.27,-3.81; 9 1.27,-6.35; 10 1.27,-3.81; 11 3.81,-6.35; 12 3.81,-3.81; 13 6.35,-6.35; 14 6.35,-3.81; 15 8.89,-6.35; 16 8.89,-3.81
FE25-2 = drill 0.914 round: 1 -30.48,1.27; 41 20.32,1.27 | drill 0.914 octagon: 2 -30.48,-1.27; 3 -27.94,1.27; 4 -27.94,-1.27; 5 -25.4,1.27; 6 -25.4,-1.27; 7 -22.86,1.27; 8 -22.86,-1.27; 9 -20.32,1.27; 10 -20.32,-1.27; 11 -17.78,1.27; 12 -17.78,-1.27; 13 -15.24,1.27; 14 -15.24,-1.27; 15 -12.7,1.27; 16 -12.7,-1.27; 17 -10.16,1.27; 18 -10.16,-1.27; 19 -7.62,1.27; 20 -7.62,-1.27; 21 -5.08,1.27; 22 -5.08,-1.27; 23 -2.54,1.27; 24 -2.54,-1.27; 25 0,1.27; 26 0,-1.27; 27 2.54,1.27; 28 2.54,-1.27; 29 5.08,1.27; 30 5.08,-1.27; 31 7.62,1.27; 32 7.62,-1.27; 33 10.16,1.27; 34 10.16,-1.27; 35 12.7,1.27; 36 12.7,-1.27; 37 15.24,1.27; 38 15.24,-1.27; 39 17.78,1.27; 40 17.78,-1.27; 42 20.32,-1.27; 43 22.86,1.27; 44 22.86,-1.27; 45 25.4,1.27; 46 25.4,-1.27; 47 27.94,1.27; 48 27.94,-1.27; 49 30.48,1.27; 50 30.48,-1.27
05 = drill 0.813 pad 1.6 octagon: 1 -2.54,0; 2 2.54,0
3,0 = hole 3: 0,0
FE08-2 = drill 0.914 octagon: 1 -8.89,1.27; 2 -8.89,-1.27; 3 -6.35,1.27; 4 -6.35,-1.27; 5 -3.81,1.27; 6 -3.81,-1.27; 7 -1.27,1.27; 8 -1.27,-1.27; 9 1.27,1.27; 10 1.27,-1.27; 11 3.81,1.27; 12 3.81,-1.27; 13 6.35,1.27; 14 6.35,-1.27; 15 8.89,1.27; 16 8.89,-1.27
DIL14 = drill 0.813 long: 1 -7.62,-3.81; 2 -5.08,-3.81; 3 -2.54,-3.81; 4 0,-3.81; 5 2.54,-3.81; 6 5.08,-3.81; 7 7.62,-3.81; 8 7.62,3.81; 9 5.08,3.81; 10 2.54,3.81; 11 0,3.81; 12 -2.54,3.81; 13 -5.08,3.81; 14 -7.62,3.81
DIL16 = drill 0.813 long: 1 -8.89,-3.81; 2 -6.35,-3.81; 3 -3.81,-3.81; 4 -1.27,-3.81; 5 1.27,-3.81; 6 3.81,-3.81; 7 6.35,-3.81; 8 8.89,-3.81; 9 8.89,3.81; 10 6.35,3.81; 11 3.81,3.81; 12 1.27,3.81; 13 -1.27,3.81; 14 -3.81,3.81; 15 -6.35,3.81; 16 -8.89,3.81
DIL20 = drill 0.813 long: 1 -11.43,-3.81; 2 -8.89,-3.81; 3 -6.35,-3.81; 4 -3.81,-3.81; 5 -1.27,-3.81; 6 1.27,-3.81; 7 3.81,-3.81; 8 6.35,-3.81; 9 8.89,-3.81; 10 11.43,-3.81; 11 11.43,3.81; 12 8.89,3.81; 13 6.35,3.81; 14 3.81,3.81; 15 1.27,3.81; 16 -1.27,3.81; 17 -3.81,3.81; 18 -6.35,3.81; 19 -8.89,3.81; 20 -11.43,3.81
2X03/90 = drill 1.016 octagon: 1 -2.54,-6.35; 2 -2.54,-3.81; 3 0,-6.35; 4 0,-3.81; 5 2.54,-6.35; 6 2.54,-3.81

### Placement (x,y rotation side)
C1  22.86,60.96 90 top
C2  82.55,60.96 90 top
C3  82.55,80.01 90 top
C4  22.86,26.67 90 top
C6  49.53,-88.9 0 top  (outside the outline)
C8  82.55,26.67 90 top
C9  121.92,60.96 90 top
C10  52.07,60.96 90 top
C11  50.8,26.67 90 top
C12  121.92,26.67 90 top
C13  120.65,80.01 90 top
C14  52.07,80.01 90 top
C15  57.15,-88.9 0 top  (outside the outline)
C16  64.77,-88.9 0 top  (outside the outline)
C17  72.39,-88.9 0 top  (outside the outline)
C18  80.01,-88.9 0 top  (outside the outline)
C19  2.54,-99.06 0 top  (outside the outline)
C20  10.16,-99.06 0 top  (outside the outline)
C21  17.78,-99.06 0 top  (outside the outline)
C22  25.4,-99.06 0 top  (outside the outline)
C23  33.02,-99.06 0 top  (outside the outline)
C24  40.64,-99.06 0 top  (outside the outline)
C26  49.53,-198.12 0 top  (outside the outline)
C27  57.15,-198.12 0 top  (outside the outline)
C28  64.77,-198.12 0 top  (outside the outline)
C29  72.39,-198.12 0 top  (outside the outline)
C30  80.01,-198.12 0 top  (outside the outline)
C31  2.54,-208.28 0 top  (outside the outline)
C32  10.16,-208.28 0 top  (outside the outline)
C33  17.78,-208.28 0 top  (outside the outline)
C34  25.4,-208.28 0 top  (outside the outline)
C35  33.02,-208.28 0 top  (outside the outline)
C36  40.64,-208.28 0 top  (outside the outline)
CONSOLE  133.35,97.79 0 top
CONTROL  87.63,6.35 0 top
F_NEG  8.89,69.85 0 top
H1  154.94,95.25 0 top
H2  154.94,5.08 0 top
H3  5.08,5.08 0 top
H4  5.08,95.25 0 top
IA  153.67,44.45 180 top
IBUS  130.81,6.35 0 top
IC3  35.56,58.42 0 top
IC4  35.56,24.13 0 top
IC5  135.89,58.42 0 top
IC7  58.42,-39.37 0 top  (outside the outline)
IC8  96.52,58.42 0 top
IC9  11.43,-53.34 0 top  (outside the outline)
IC10  64.77,24.13 0 top
IC11  66.04,58.42 0 top
IC12  138.43,24.13 0 top
IC13  99.06,24.13 0 top
IC14  40.64,-25.4 0 top  (outside the outline)
IC15  64.77,-25.4 0 top  (outside the outline)
IC16  11.43,-39.37 0 top  (outside the outline)
IC17  35.56,-39.37 0 top  (outside the outline)
IC18  50.8,-7.62 0 top  (outside the outline)
IC19  15.24,-25.4 0 top  (outside the outline)
IC23  58.42,-148.59 0 top  (outside the outline)
IC24  11.43,-162.56 0 top  (outside the outline)
IC25  41.91,-134.62 0 top  (outside the outline)
IC26  66.04,-134.62 0 top  (outside the outline)
IC27  11.43,-148.59 0 top  (outside the outline)
IC28  35.56,-148.59 0 top  (outside the outline)
IC29  50.8,-115.57 0 top  (outside the outline)
IC30  15.24,-134.62 0 top  (outside the outline)
IC31  33.02,-162.56 0 top  (outside the outline)
IC32  54.61,-162.56 0 top  (outside the outline)
IC33  76.2,-162.56 0 top  (outside the outline)
IDR  153.67,49.53 180 top
IPC  153.67,46.99 180 top
LOAD_WIDTH  6.35,57.15 90 top
LOAD_WIDTH1  6.35,-10.16 0 top  (outside the outline)
LOAD_WIDTH2  6.35,-119.38 0 top  (outside the outline)
RA  83.82,13.97 90 top
RDR  77.47,13.97 90 top
RPC  74.93,13.97 90 top
U$1  6.35,11.43 0 top
U$2  30.48,73.66 0 bottom
U$3  16.51,43.18 0 top
WA  48.26,16.51 180 top
WDR  48.26,13.97 180 top
WPC  48.26,11.43 180 top

### Tracks (layer width: path | path; a pad name or v marks a point on that pad's centre or on a via)
-INC_REG  (5 unrouted)
-INCA  (1 unrouted)
-INCDR  (1 unrouted)
-INCPC  (1 unrouted)
-R_A  (1 unrouted)
-R_DR  (1 unrouted)
-R_PC  (1 unrouted)
-R_REG  (14 unrouted)
-RESET  (6 unrouted)
-W_A  (1 unrouted)
-W_DR  (1 unrouted)
-W_PC  (1 unrouted)
-W_REG  (11 unrouted)
F_ZERO  (1 unrouted)
GND  (65 unrouted)
  pour Bottom (isolate 0.508, no thermals): 30.48,8.89 29.21,7.62 29.21,5.08 30.48,3.81 33.02,3.81 34.29,5.08 34.29,7.62 33.02,8.89
  pour Bottom (isolate 0.61, no thermals): 0,100.33 0,0 160.02,0 160.02,100.33
IBUS0  (6 unrouted)
IBUS1  (6 unrouted)
IBUS2  (6 unrouted)
IBUS3  (6 unrouted)
IBUS4  (6 unrouted)
IBUS5  (6 unrouted)
IBUS6  (6 unrouted)
IBUS7  (6 unrouted)
IBUS8  (6 unrouted)
IBUS9  (6 unrouted)
IBUS10  (6 unrouted)
IBUS11  (6 unrouted)
IBUS12  (6 unrouted)
IBUS13  (6 unrouted)
IBUS14  (6 unrouted)
IBUS15  (6 unrouted)
LOAD  (14 unrouted)
N$5  (3 unrouted)
N$6  (2 unrouted)
N$7  (3 unrouted)
N$8  (2 unrouted)
N$9  (1 unrouted)
N$10  (3 unrouted)
N$11  (2 unrouted)
N$12  (4 unrouted)
N$13  (1 unrouted)
N$14  (1 unrouted)
N$15  (1 unrouted)
N$17  (3 unrouted)
N$18  (2 unrouted)
N$19  (3 unrouted)
N$20  (2 unrouted)
N$21  (1 unrouted)
N$22  (3 unrouted)
N$23  (2 unrouted)
N$25  (1 unrouted)
N$26  (4 unrouted)
N$29  (1 unrouted)
N$30  (3 unrouted)
N$31  (1 unrouted)
N$32  (2 unrouted)
N$33  (3 unrouted)
N$34  (2 unrouted)
N$35  (1 unrouted)
N$36  (3 unrouted)
N$37  (2 unrouted)
N$38  (4 unrouted)
N$39  (1 unrouted)
N$40  (1 unrouted)
N$41  (1 unrouted)
N$42  (1 unrouted)
N$43  (1 unrouted)
N$44  (1 unrouted)
N$45  (1 unrouted)
REG0  (7 unrouted)
REG1  (7 unrouted)
REG2  (7 unrouted)
REG3  (7 unrouted)
REG4  (7 unrouted)
REG5  (7 unrouted)
REG6  (7 unrouted)
REG7  (7 unrouted)
REG8  (7 unrouted)
REG9  (7 unrouted)
REG10  (7 unrouted)
REG11  (7 unrouted)
REG12  (7 unrouted)
REG13  (7 unrouted)
REG14  (7 unrouted)
REG15  (8 unrouted)
VCC  (49 unrouted)
  pour Top (isolate 0.508, no thermals): 20.32,8.89 19.05,7.62 19.05,5.08 20.32,3.81 22.86,3.81 24.13,5.08 24.13,7.62 22.86,8.89
  pour Top (isolate 0.61, rank 6, no thermals): 0,100.33 0,0 160.02,0 160.02,100.33
VDD  (10 unrouted)
VSS  (10 unrouted)

### Text on the board
Top: (c) 2011 AlexiosC
Bottom: (c) 2011 AlexiosC
tNames: http://www.bedroomlan.org/hardware/cft | A only | A only | A only | PC only | A only | 3 | 2 | 1 | (c) 2011 AlexiosC | CFT CPU PC/DR/A Register Rev A
tValues: +12V | +5V | GND